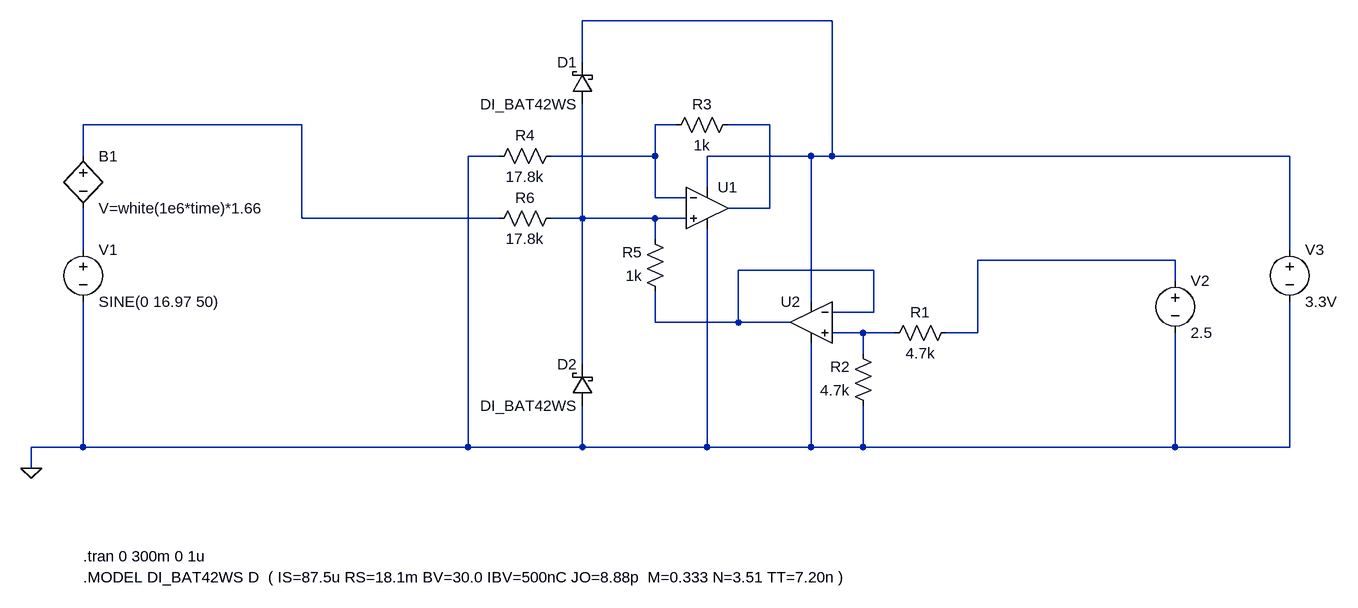
[diagram p0: schematic ZCD.asc]
ZCD.asc, the LTspice schematic file:
Version 4.1
SHEET 1 2272 872
WIRE 1488 0 1104 0
WIRE 1104 64 1104 0
WIRE 672 160 336 160
WIRE 1248 160 1216 160
WIRE 1392 160 1328 160
WIRE 336 208 336 160
WIRE 976 208 928 208
WIRE 1216 208 1216 160
WIRE 1216 208 1056 208
WIRE 1456 208 1296 208
WIRE 1488 208 1488 0
WIRE 1488 208 1456 208
WIRE 2192 208 1488 208
WIRE 1296 256 1296 208
WIRE 1216 272 1216 208
WIRE 1264 272 1216 272
WIRE 1392 288 1392 160
WIRE 1392 288 1328 288
WIRE 672 304 672 160
WIRE 976 304 672 304
WIRE 1104 304 1104 128
WIRE 1104 304 1056 304
WIRE 1216 304 1104 304
WIRE 1264 304 1216 304
WIRE 1216 336 1216 304
WIRE 336 352 336 288
WIRE 2192 352 2192 208
WIRE 2016 368 1712 368
WIRE 1552 384 1344 384
WIRE 2016 400 2016 368
WIRE 1456 432 1456 208
WIRE 1552 448 1552 384
WIRE 1552 448 1488 448
WIRE 1216 464 1216 416
WIRE 1344 464 1344 384
WIRE 1344 464 1216 464
WIRE 1424 464 1344 464
WIRE 1536 480 1488 480
WIRE 1584 480 1536 480
WIRE 1712 480 1712 368
WIRE 1712 480 1664 480
WIRE 1536 512 1536 480
WIRE 1104 528 1104 304
WIRE 336 656 336 432
WIRE 336 656 256 656
WIRE 928 656 928 208
WIRE 928 656 336 656
WIRE 1104 656 1104 592
WIRE 1104 656 928 656
WIRE 1296 656 1296 320
WIRE 1296 656 1104 656
WIRE 1456 656 1456 496
WIRE 1456 656 1296 656
WIRE 1536 656 1536 592
WIRE 1536 656 1456 656
WIRE 2016 656 2016 480
WIRE 2016 656 1536 656
WIRE 2192 656 2192 432
WIRE 2192 656 2016 656
WIRE 256 688 256 656
FLAG 256 688 0
SYMBOL voltage 336 336 R0
WINDOW 123 0 0 Left 0
WINDOW 39 0 0 Left 0
SYMATTR InstName V1
SYMATTR Value SINE(0 16.97 50)
SYMBOL bv 336 192 R0
SYMATTR InstName B1
SYMATTR Value V=white(1e6*time)*1.66
SYMBOL OpAmps\\UniversalOpAmp 1296 288 R0
SYMATTR InstName U1
SYMBOL OpAmps\\UniversalOpAmp 1456 464 M0
SYMATTR InstName U2
SYMBOL voltage 2016 384 R0
SYMATTR InstName V2
SYMATTR Value 2.5
SYMBOL res 1680 464 R90
WINDOW 0 0 56 VBottom 2
WINDOW 3 32 56 VTop 2
SYMATTR InstName R1
SYMATTR Value 4.7k
SYMBOL res 1552 608 R180
WINDOW 0 36 76 Left 2
WINDOW 3 36 40 Left 2
SYMATTR InstName R2
SYMATTR Value 4.7k
SYMBOL voltage 2192 336 R0
WINDOW 123 0 0 Left 0
WINDOW 39 0 0 Left 0
SYMATTR InstName V3
SYMATTR Value 3.3V
SYMBOL res 1344 144 R90
WINDOW 0 0 56 VBottom 2
WINDOW 3 32 56 VTop 2
SYMATTR InstName R3
SYMATTR Value 1k
SYMBOL res 1072 192 R90
WINDOW 0 0 56 VBottom 2
WINDOW 3 32 56 VTop 2
SYMATTR InstName R4
SYMATTR Value 17.8k
SYMBOL res 1232 432 R180
WINDOW 0 36 76 Left 2
WINDOW 3 36 40 Left 2
SYMATTR InstName R5
SYMATTR Value 1k
SYMBOL res 960 320 R270
WINDOW 0 32 56 VTop 2
WINDOW 3 0 56 VBottom 2
SYMATTR InstName R6
SYMATTR Value 17.8k
SYMBOL schottky 1120 592 R180
WINDOW 0 24 64 Left 2
WINDOW 3 24 0 Left 2
SYMATTR InstName D2
SYMATTR Value DI_BAT42WS
SYMBOL schottky 1120 128 R180
WINDOW 0 24 64 Left 2
WINDOW 3 24 0 Left 2
SYMATTR InstName D1
SYMATTR Value DI_BAT42WS
TEXT 336 824 Left 2 !.tran 0 300m 0 1u
TEXT 336 856 Left 2 !.MODEL DI_BAT42WS D  ( IS=87.5u RS=18.1m BV=30.0 IBV=500nC JO=8.88p  M=0.333 N=3.51 TT=7.20n )

The netlist it stands for:
* ZCD.asc
V1 N006 0 SINE(0 16.97 50)
B1 N002 N006 V=white(1e6*time)*1.66
X§U1 N005 N003 N001 0 N004 level1 Avol=1Meg GBW=10Meg Vos=0 En=0 Enk=0 In=0 Ink=0 Rin=500Meg  ; pins In+ In- V+ V- OUT
X§U2 N009 N008 N001 0 N008 level1 Avol=1Meg GBW=10Meg Vos=0 En=0 Enk=0 In=0 Ink=0 Rin=500Meg  ; pins In+ In- V+ V- OUT
V2 N007 0 2.5
R1 N007 N009 4.7k
R2 0 N009 4.7k
V3 N001 0 3.3V
R3 N004 N003 1k
R4 N003 0 17.8k
R5 N008 N005 1k
R6 N002 N005 17.8k
D2 0 N005 DI_BAT42WS
D1 N005 N001 DI_BAT42WS
.model D D
.lib standard.dio
.tran 0 300m 0 1u
.MODEL DI_BAT42WS D  ( IS=87.5u RS=18.1m BV=30.0 IBV=500nC JO=8.88p  M=0.333 N=3.51 TT=7.20n )
.lib UniversalOpAmp1.lib
.backanno
.end